# EAGLE design FLEXQCM V1.2 (EAGLE 7.2.0)
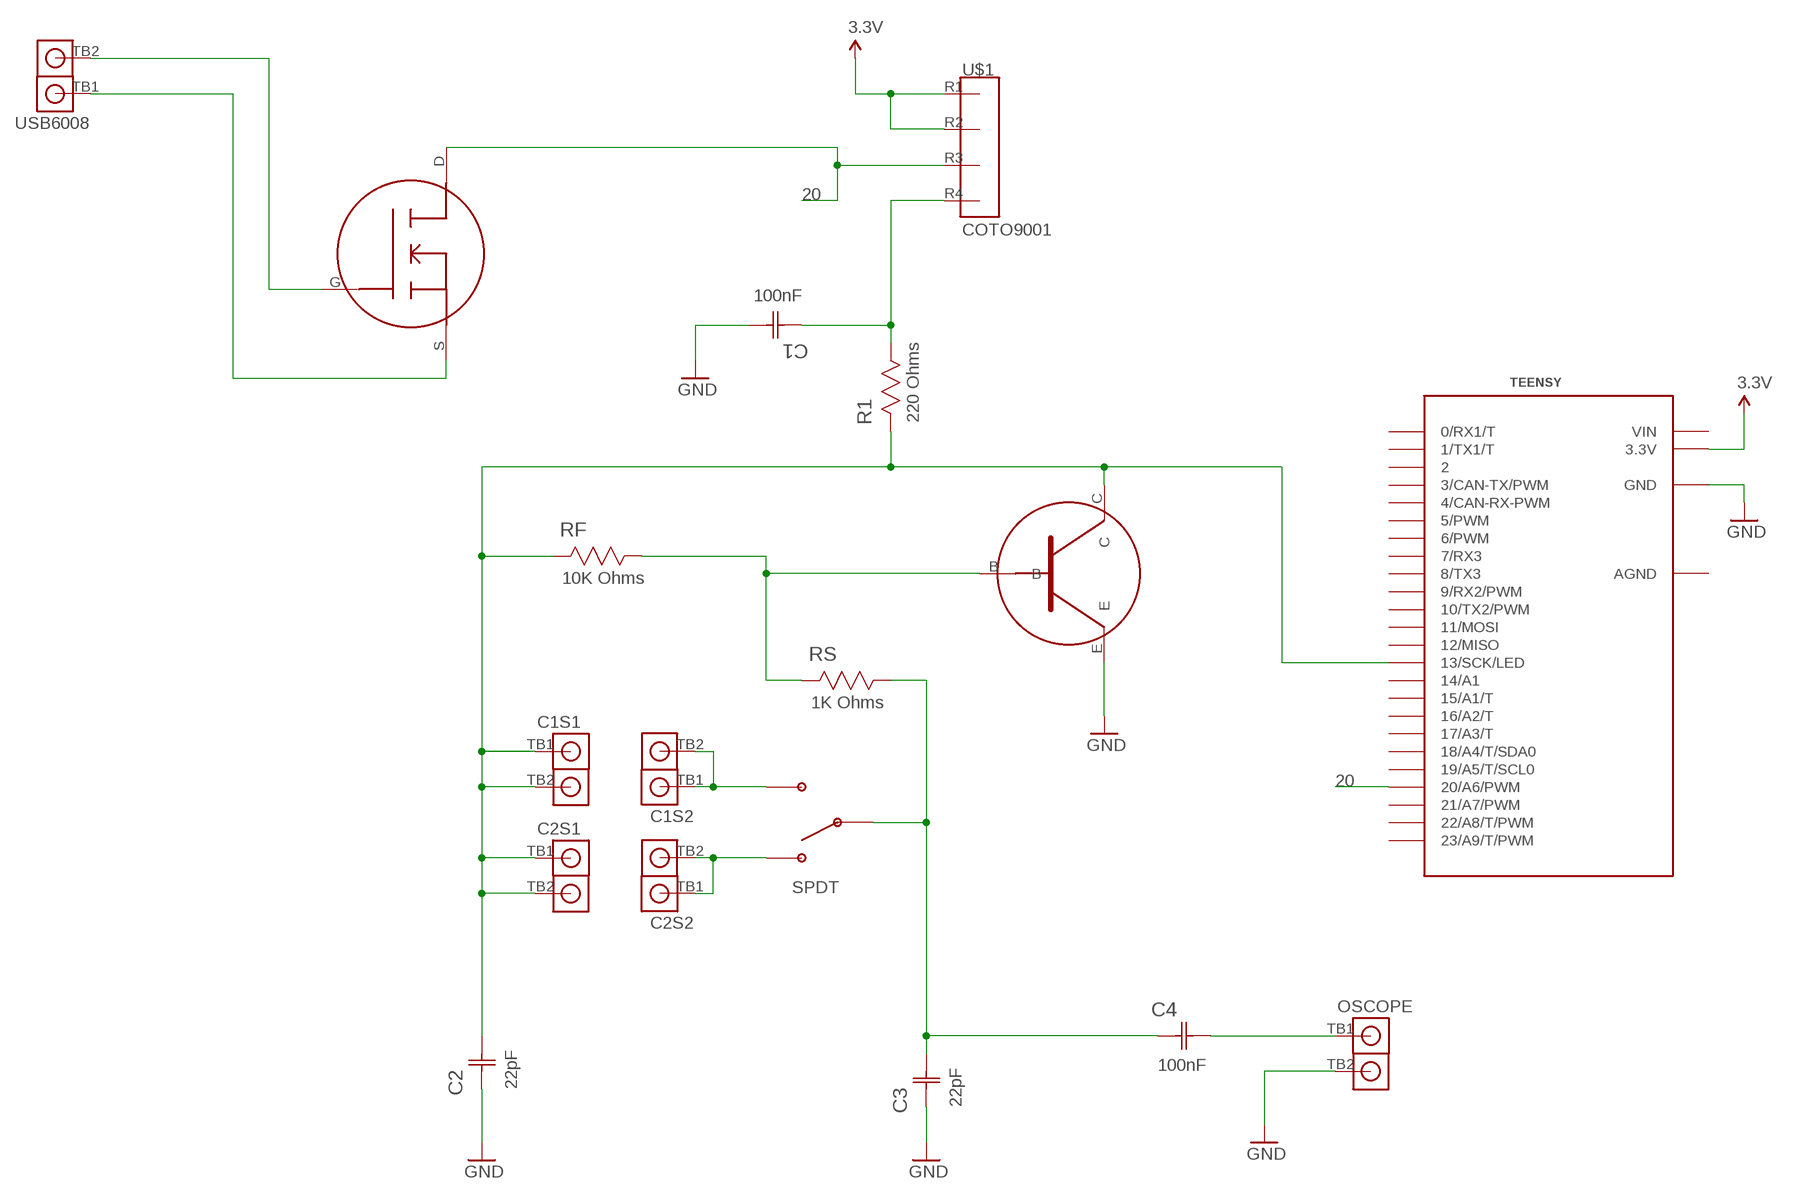
[diagram p0: schematic, sheet 1]

## Parts
C1  100nF  C1206C104K1RACTU  [CAPC3216X88N]
C1S1  TERMBLOCKX2  [TERMBLOCKX2]
C1S2  TERMBLOCKX2  [TERMBLOCKX2]
C2  22pF  C1206C220J5GACTU  [CAPC3216X88N]
C2S1  TERMBLOCKX2  [TERMBLOCKX2]
C2S2  TERMBLOCKX2  [TERMBLOCKX2]
C3  22pF  C1206C220J5GACTU  [CAPC3216X88N]
C4  100nF  C1206C104K1RACTU  [CAPC3216X88N]
OSCOPE  TERMBLOCKX2  [TERMBLOCKX2]
R1  220 Ohms  CRCW1206220RJNEA  [RESC3216X71N]
RF  10K Ohms  CRCW120610K0FKEA  [RESC3216X71N]
RS  1K Ohms  CRCW12061K00FKEA  [RESC3216X71N]
SPDT  SPDTSWITCH  [SPDTSWITCH]
TEENSY  TEENSY_3.1_DIL  [TEENSY3-DIL]
U1  2N7002BK  [SOT95P230X110-3N]
U2  BC847C-7-F  [SOT103P240X110-3N]
U$1  COTO9001  [COTO9001]
USB6008  TERMBLOCKX2  [TERMBLOCKX2]

## Nets
3V3: TEENSY.3.3V U$1.R1 U$1.R2 ; supply symbol labelled 3.3V
13: C1S1.TB1 C1S1.TB2 C2.2(C2) C2S1.TB1 C2S1.TB2 R1.2 RF.2 TEENSY.13(13/SCK/LED) U2.C
20: TEENSY.20/A6(20/A6/PWM) U1.D U$1.R3
GND: C1.2(C2) C2.1(C1) C3.1(C1) OSCOPE.TB2 TEENSY.GND U2.E
N$1: U1.G USB6008.TB2
N$2: U1.S USB6008.TB1
N$3: C1S2.TB1 C1S2.TB2 SPDT.SW3
N$4: C1.1(C1) R1.1 U$1.R4
N$5: C2S2.TB1 C2S2.TB2 SPDT.SW1
N$6: RF.1 RS.2 U2.B
N$7: C4.2(C2) OSCOPE.TB1
N$8: C3.2(C2) C4.1(C1) RS.1 SPDT.SW2
Unconnected: TEENSY.0(0/RX1/T) TEENSY.1(1/TX1/T) TEENSY.2 TEENSY.3(3/CAN-TX/PWM) TEENSY.4(4/CAN-RX-PWM) TEENSY.5(5/PWM) TEENSY.6(6/PWM) TEENSY.7(7/RX3) TEENSY.8(8/TX3) TEENSY.9(9/RX2/PWM) TEENSY.10(10/TX2/PWM) TEENSY.11(11/MOSI) TEENSY.12(12/MISO) TEENSY.14/A0(14/A1) TEENSY.15/A1(15/A1/T) TEENSY.16/A2(16/A2/T) TEENSY.17/A3(17/A3/T) TEENSY.18/A4(18/A4/T/SDA0) TEENSY.19/A5(19/A5/T/SCL0) TEENSY.21/A7(21/A7/PWM) TEENSY.22/A8(22/A8/T/PWM) TEENSY.23/A9(23/A9/T/PWM)

## Power pins joined to a net without a drawn wire
AGND: TEENSY.AGND
VIN: TEENSY.VIN

## Library data of the parts
C1 C4 = Kemet_By_element14_Batch_1:C1206C104K1RACTU: CAPACITOR, 1206; MPN: C1206C104K1RACTU; OC_FARNELL: 1414714; OC_NEWARK: 85C2205; SUPPLIER: Kemet; TOLERANCE: ±10%; VOLTAGERATING: 100V
C1S1 C1S2 C2S1 C2S2 OSCOPE USB6008 = FLEXQCMLIBRARY:TERMBLOCKX2
C2 C3 = Kemet_By_element14_Batch_1:C1206C220J5GACTU: CAPACITOR, 1206; MPN: C1206C220J5GACTU; OC_FARNELL: 1414717; OC_NEWARK: 70K9304; SUPPLIER: Kemet; TOLERANCE: ±5%; VOLTAGERATING: 50V
R1 = Vishay_By_element14_Batch_1:CRCW1206220RJNEA: RESISTOR, 1206; MPN: CRCW1206220RJNEA; OC_FARNELL: -; OC_NEWARK: 59M6970; SUPPLIER: Vishay; TOLERANCE: ±5%; WATTAGE: 0.25W
RF = Vishay_By_element14_Batch_1:CRCW120610K0FKEA: RESISTOR, 1206; MPN: CRCW120610K0FKEA; OC_FARNELL: 1469970; OC_NEWARK: 53K1907; SUPPLIER: Vishay; TOLERANCE: ±1%; WATTAGE: 0.25W
RS = Vishay_By_element14_Batch_1:CRCW12061K00FKEA: RESISTOR, 1206; MPN: CRCW12061K00FKEA; OC_FARNELL: 1469965; OC_NEWARK: 53K1780; SUPPLIER: Vishay; TOLERANCE: ±1%; WATTAGE: 0.25W
SPDT = FLEXQCMLIBRARY:SPDTSWITCH
TEENSY = Teensy_3_and_LC_Series_Boards_v1.0:TEENSY_3.1_DIL: Teensy 3.1 or 3.2 in a DIL Layout.
U1 = NXP_By_element14_Batch_1:2N7002BK: MOSFET; MPN: 2N7002BK; OC_FARNELL: 1859847; OC_NEWARK: 28T0305; PACKAGE: SOT-23-3; SUPPLIER: NXP
U2 = Diodes_Inc_By_element14_Batch_1:BC847C-7-F: NPN SURFACE MOUNT SMALL SIGNAL TRANSISTOR; MPN: BC847C-7-F; OC_FARNELL: 1773609; OC_NEWARK: 51R6395; PACKAGE: SOT-23-3; SUPPLIER: DIODES INC.
U$1 = FLEXQCMLIBRARY:COTO9001

## Board
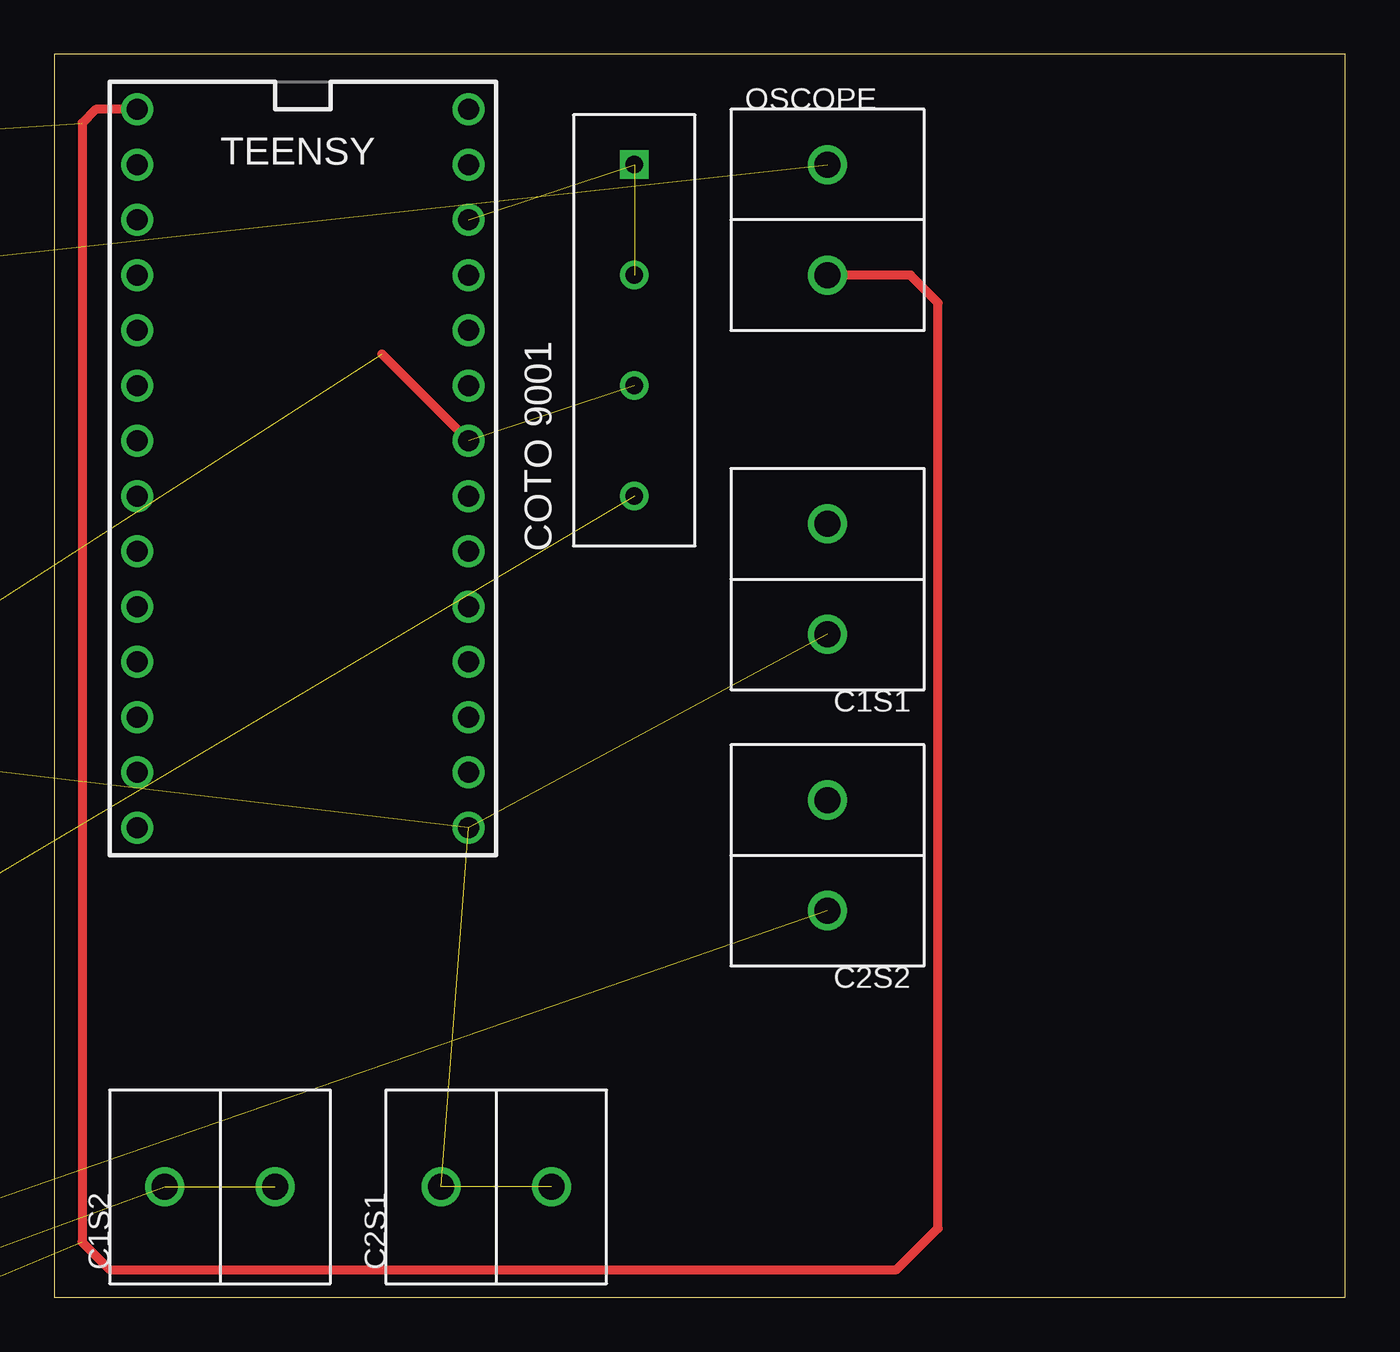
[diagram p1: board, top side]
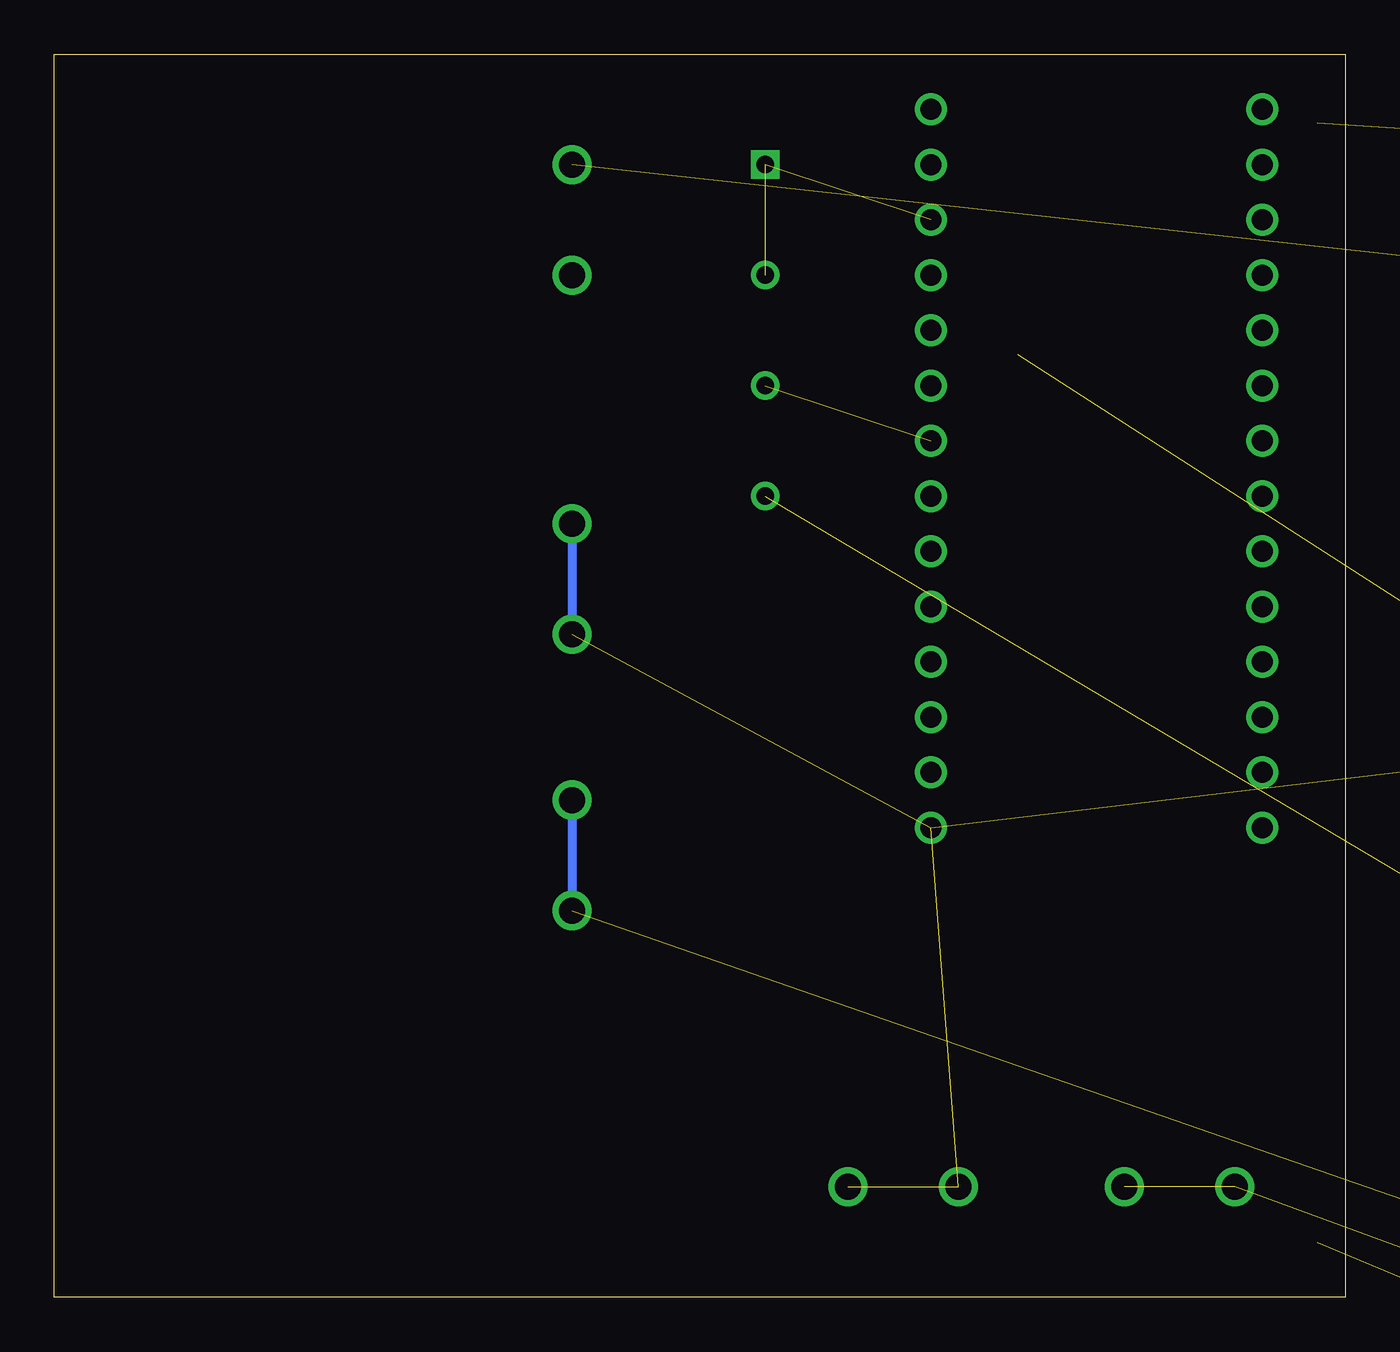
[diagram p2: board, bottom side, seen from below]

Size 59.36 x 57.14 mm. Coordinates in mm from the lower left corner, seen from the top.
Outline: 0,0 59.36,0 59.36,57.14 0,57.14 0,0
Copper layers (1*16): Top 0.035mm / dielectric 1.5mm / Bottom 0.035mm
Design rules "default": minimum track width 10mil, minimum drill 24mil, track to track 8mil, track to pad 8mil, pad to pad 8mil, via to via 8mil, smd to smd 8mil, copper to edge 40mil, drill to drill 8mil, minimum pad ring 10mil, minimum via ring 8mil, stop-mask expansion 4mil, vias tented up to drill 0mil, thermal gap 10mil

### Footprints (pad centres in the part's own frame; a part is rotated, then mirrored left to right if it is on the bottom)
CAPC3216X88N = smd 0.914 x 1.803: 1 -1.397,0; 2 1.397,0
TERMBLOCKX2 = drill 1.2: TB1 0,2.54; TB2 0,-2.54
RESC3216X71N = smd 1.118 x 1.753: 1 -1.473,0; 2 1.473,0
SPDTSWITCH = drill 0.8 square: SW1 0,2.54 | drill 0.8: SW2 0,0; SW3 0,-2.54
TEENSY3-DIL = drill 0.965: 0 -7.62,13.97; 1 -7.62,11.43; 2 -7.62,8.89; 3 -7.62,6.35; 3.3V 7.62,11.43; 4 -7.62,3.81; 5 -7.62,1.27; 6 -7.62,-1.27; 7 -7.62,-3.81; 8 -7.62,-6.35; 9 -7.62,-8.89; 10 -7.62,-11.43; 11 -7.62,-13.97; 12 -7.62,-16.51; 13 7.62,-16.51; 14/A0 7.62,-13.97; 15/A1 7.62,-11.43; 16/A2 7.62,-8.89; 17/A3 7.62,-6.35; 18/A4 7.62,-3.81; 19/A5 7.62,-1.27; 20/A6 7.62,1.27; 21/A7 7.62,3.81; 22/A8 7.62,6.35; 23/A9 7.62,8.89; AGND 7.62,13.97; GND -7.62,16.51; VIN 7.62,16.51
SOT95P230X110-3N = smd 1.168 x 0.533: D 1.092,0; G -1.092,0.94; S -1.092,-0.94
SOT103P240X110-3N = smd 1.321 x 0.559: B -1.016,1.016; C 1.016,0; E -1.016,-1.016
COTO9001 = drill 0.8 square: R1 0,7.62 | drill 0.8: R2 0,2.54; R3 0,-2.54; R4 0,-7.62

### Placement (x,y rotation side)
C1  -100.33,-39.37 0 top  (outside the outline)
C1S1  35.56,33.02 180 top
C1S2  7.62,5.08 90 top
C2  -177.8,-66.04 0 top  (outside the outline)
C2S1  20.32,5.08 90 top
C2S2  35.56,20.32 180 top
C3  -26.67,52.07 0 top  (outside the outline)
C4  -58.42,41.91 0 top  (outside the outline)
OSCOPE  35.56,49.53 0 top
R1  -162.56,-60.96 0 top  (outside the outline)
RF  -57.15,30.48 0 top  (outside the outline)
RS  -38.1,41.91 0 top  (outside the outline)
SPDT  -147.32,-48.26 0 top  (outside the outline)
TEENSY  11.43,38.1 0 top
U1  -160.02,-68.58 0 top  (outside the outline)
U2  -175.26,-73.66 0 top  (outside the outline)
U$1  26.67,44.45 0 top
USB6008  -170.18,-63.5 0 top  (outside the outline)

### Tracks (layer width: path | path; a pad name or v marks a point on that pad's centre or on a via)
3V3  (2 unrouted)
13  (7 unrouted)
  Bottom 0.406: C1S1.TB2 C1S1.TB1
20  (2 unrouted)
  Top 0.406: 15.06,43.36 TEENSY.20/A6
GND  (4 unrouted)
  Top 0.406: TEENSY.GND 1.91,54.61 1.27,53.97 1.27,2.54 2.54,1.27 38.73,1.27 40.64,3.18 40.64,45.72 39.37,46.99 OSCOPE.TB2
N$1  (1 unrouted)
N$2  (1 unrouted)
N$3  (2 unrouted)
N$4  (2 unrouted)
N$5  (1 unrouted)
  Bottom 0.406: C2S2.TB2 C2S2.TB1
N$6  (2 unrouted)
N$7  (1 unrouted)
N$8  (3 unrouted)